# EAGLE design 2x_Rollo_APP_TS_v0.1 (EAGLE 6.4)
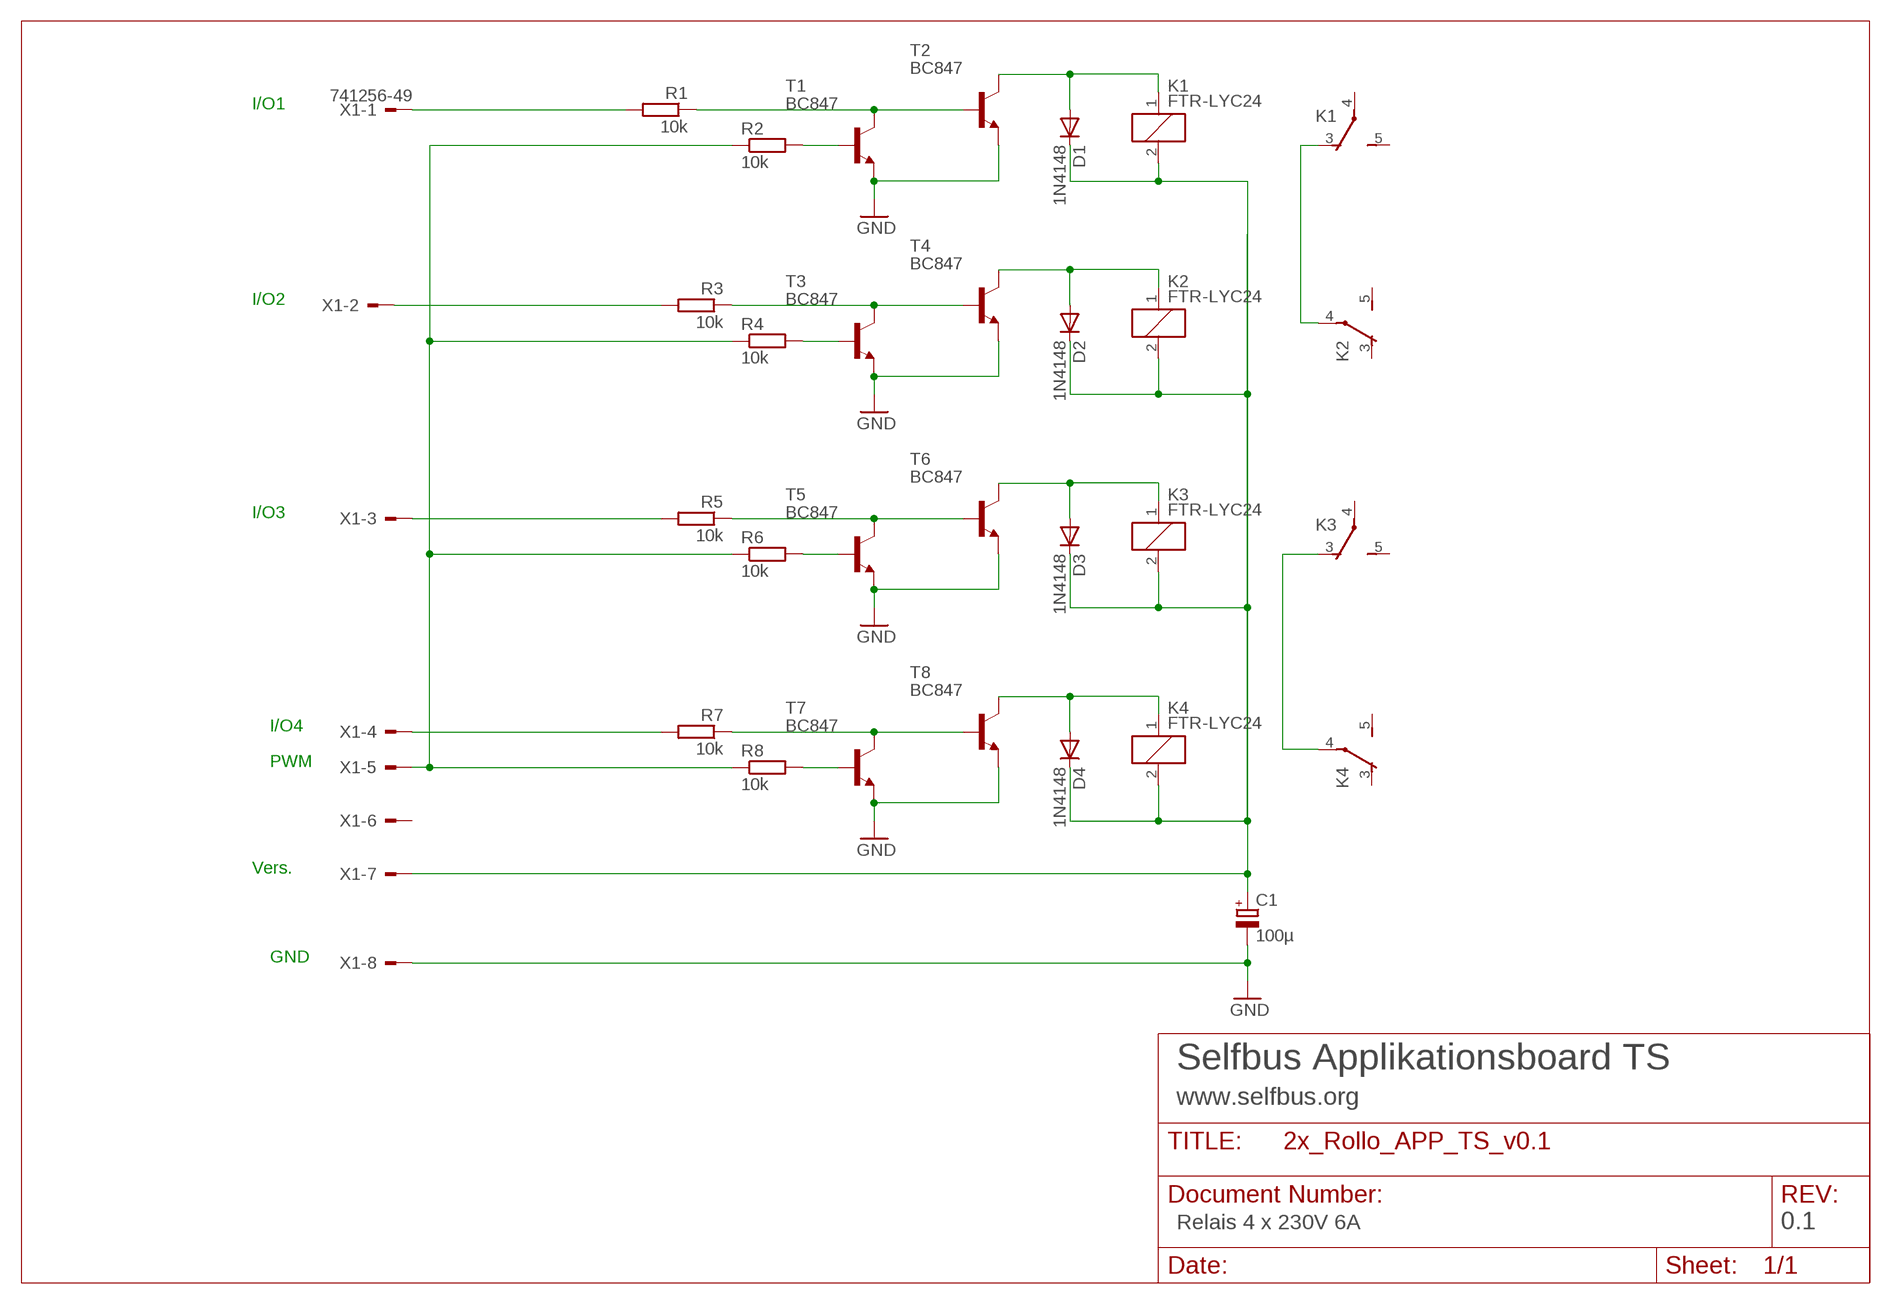
[diagram p0: schematic, sheet 1]

## Parts
C1  100µ  CPOL-EUE2.5-6  [E2,5-6]
D1  1N4148  DIODE-MINIMELF  [MINIMELF]
D2  1N4148  DIODE-MINIMELF  [MINIMELF]
D3  1N4148  DIODE-MINIMELF  [MINIMELF]
D4  1N4148  DIODE-MINIMELF  [MINIMELF]
K1  FTR-LYC24  [FTR-LYC]
K2  FTR-LYC24  [FTR-LYC]
K3  FTR-LYC24  [FTR-LYC]
K4  FTR-LYC24  [FTR-LYC]
R1  10k  R-EU_M1206  [M1206]
R2  10k  R-EU_M1206  [M1206]
R3  10k  R-EU_M1206  [M1206]
R4  10k  R-EU_M1206  [M1206]
R5  10k  R-EU_M1206  [M1206]
R6  10k  R-EU_M1206  [M1206]
R7  10k  R-EU_M1206  [M1206]
R8  10k  R-EU_M1206  [M1206]
T1  BC847  [SOT23]
T2  BC847  [SOT23]
T3  BC847  [SOT23]
T4  BC847  [SOT23]
T5  BC847  [SOT23]
T6  BC847  [SOT23]
T7  BC847  [SOT23]
T8  BC847  [SOT23]
X1  741256-49  [741256-49]

## Nets
GND: C1.- T1.2(E) T2.2(E) T3.2(E) T4.2(E) T5.2(E) T6.2(E) T7.2(E) T8.2(E) X1.8
N$2: R1.2 X1.1
N$4: R3.2 X1.2
N$7: R2.1 R4.1 R6.1 R8.1 X1.5
N$8: R3.1 T3.3(C) T4.1(B)
N$9: R4.2 T3.1(B)
N$10: R5.2 X1.3
N$11: R5.1 T5.3(C) T6.1(B)
N$12: R6.2 T5.1(B)
N$13: R7.2 X1.4
N$14: R1.1 T1.3(C) T2.1(B)
N$15: R7.1 T7.3(C) T8.1(B)
N$18: R8.2 T7.1(B)
N$21: R2.2 T1.1(B)
N$29: K3.3(-1:O) K4.4(-1:P)
N$31: K1.3(-1:O) K2.4(-1:P)
R1: D2.A K2.1 T4.3(C)
R2: D3.A K3.1 T6.3(C)
R3: D1.A K1.1 T2.3(C)
R4: D4.A K4.1 T8.3(C)
VDD_IN1: C1.+ D1.C D2.C D3.C D4.C K1.2 K2.2 K3.2 K4.2 X1.7
Unconnected: K1.4(-1:P) K1.5(-1:S) K2.3(-1:O) K2.5(-1:S) K3.4(-1:P) K3.5(-1:S) K4.3(-1:O) K4.5(-1:S) X1.6

## Notes on the sheet
- I/O1
- I/O2
- I/O3
- I/O4
- PWM
- Vers.
- GND
- Selfbus Applikationsboard TS
- www.selfbus.org
- Relais 4 x 230V 6A | 0.1

## Library data of the parts
C1 = rcl:CPOL-EU: POLARIZED CAPACITOR, European symbol
D1-D4 = diode:DIODE-: DIODE
K1-K4 = relay:FTR-LYC: Schmales Netzrelais NETZRELAIS FTR-LYCA024V 1XUM 6A/250VAC Distributor: Conrad electronic Bestell Nr.: 504382 - 62 Source: http://www2.produktinfo.conrad.com/datenblaetter/500000-524999/504382-da-01-de-NETZRELAIS_FTR-LYCA024V_1XUM_6A_250VAC.pdf; OC_FARNELL: unknown; OC_NEWARK: unknown
R1-R8 = rcl:R-EU_: RESISTOR, European symbol
T1-T8 = transistor:BC847: NPN TRANSISTOR
X1 = con-conrad:741256-49: Connector with Kabel

## Board
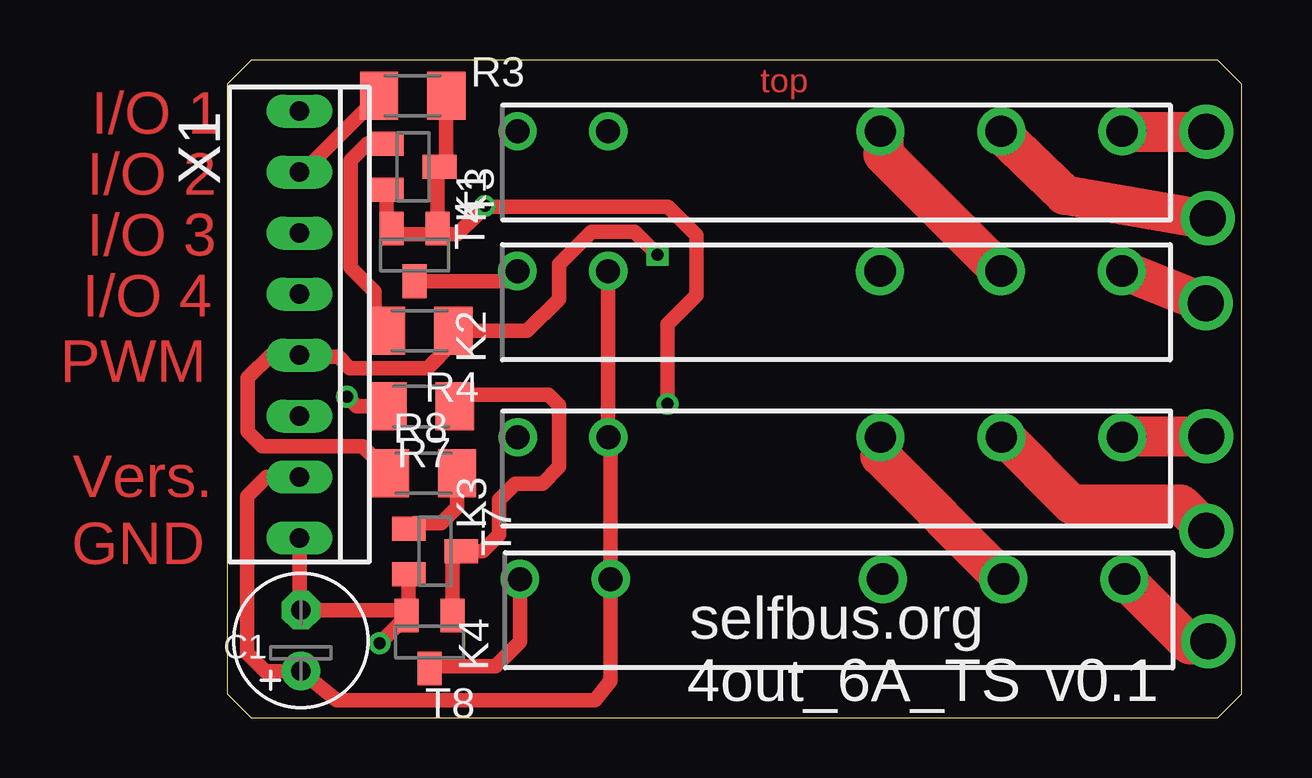
[diagram p1: board, top side]
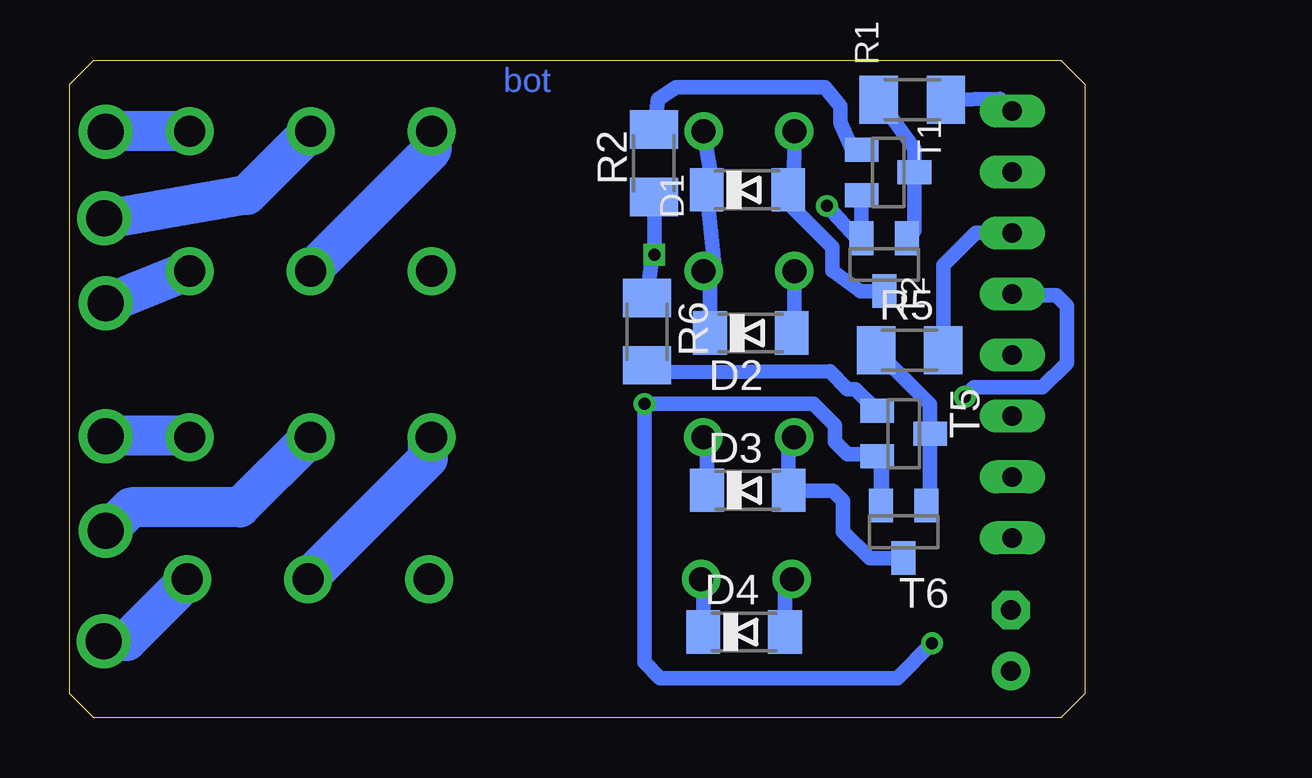
[diagram p2: board, bottom side, seen from below]

Size 42.3 x 27.4 mm. Coordinates in mm from the lower left corner, seen from the top.
Outline: 1,0 41.3,0 42.3,1 42.3,26.4 41.3,27.4 1,27.4 0,26.4 0,1 1,0
Copper layers (1*16): Top 0.035mm / dielectric 1.5mm / Bottom 0.035mm
Design rules "default_freebus": minimum track width 10mil, minimum drill 24mil, track to track 8mil, track to pad 8mil, pad to pad 8mil, via to via 8mil, smd to smd 8mil, copper to edge 12mil, drill to drill 8mil, minimum pad ring 11mil, minimum via ring 8mil, stop-mask expansion 4mil, vias tented up to drill 0mil, thermal gap 10mil

### Footprints (pad centres in the part's own frame; a part is rotated, then mirrored left to right if it is on the bottom)
E2,5-6 = drill 0.813 pad 1.6: + -1.27,0 | drill 0.813 pad 1.6 octagon: - 1.27,0
MINIMELF = smd 1.4 x 1.8: A 1.7,0; C -1.7,0
FTR-LYC = drill 1 pad 1.6: 1 -3.78,0; 2 0,0 | drill 1.3 pad 2: 3 11.34,0; 4 16.38,0; 5 21.42,0
M1206 = smd 1.6 x 2: 1 -1.4,0; 2 1.4,0
SOT23 = smd 1 x 1.4: 1 -0.95,-1.1; 2 0.95,-1.1; 3 0,1.1
741256-49 = drill 0.813 pad 1.27 long: 1 -8.89,0; 2 -6.35,0; 3 -3.81,0; 4 -1.27,0; 5 1.27,0; 6 3.81,0; 7 6.35,0; 8 8.89,0

### Placement (x,y rotation side)
C1  3.08,3.21 90 top
D1  14.06,21.99 0 bottom
D2  13.92,16.02 0 bottom
D3  14.04,9.47 0 bottom
D4  14.19,3.57 0 bottom
K1  15.89,24.43 0 top
K2  15.88,18.6 0 top
K3  15.89,11.68 0 top
K4  15.99,5.77 0 top
R1  7.19,25.74 0 bottom
R2  17.96,23.1 90 bottom
R3  7.74,25.91 180 top
R4  8.03,16.11 180 top
R5  7.29,15.31 0 bottom
R6  18.24,16.08 270 bottom
R7  8.09,12.96 180 top
R8  8.18,10.18 0 top
T1  8.2,22.72 270 bottom
T2  8.36,18.87 180 bottom
T3  7.75,22.95 270 top
T4  7.82,19.28 180 top
T5  7.55,11.83 270 bottom
T6  7.55,7.74 180 bottom
T7  8.67,6.93 270 top
T8  8.44,3.15 180 top
X1  3.01,16.38 270 top

### Tracks (layer width: path | path; a pad name or v marks a point on that pad's centre or on a via)
GND  (via drill 0.5)
  Top 0.61: X1.8 3.01,4.54 C1.- 7.26,4.48 T8.2 7.57,4.33 T7.2 7.57,4.69 7.36,4.47 7.36,4.09 v6.36,3.09 | T3.2 6.65,20.59 T4.2 7.11,20.14 9.6,20.14 10.39,20.94 v10.75,21.32 10.78,21.28 18.38,21.28 19.57,20.1 19.57,17.59 18.35,16.38 v18.35,13.07
  Bottom 0.61: T1.2 9.3,19.98 | 9.3,19.98 T2.2 | T5.2 8.5,10.73 T6.2 8.45,8.9 8.45,10.93 8.49,10.97 9.88,10.97 10.41,11.5 10.41,12.18 11.3,13.07 v18.35,13.07 18.35,2.31 17.69,1.65 7.8,1.65 v6.36,3.09 | 9.3,19.98 9.47,19.96 v10.75,21.32
N$1  (via drill 1.5 pad 2.18)
  Top 1.676: 37.31,24.39 37.31,24.42 v40.81,24.42
N$2
  Bottom 0.61: X1.1 3.52,25.78 R1.2
N$3  (via drill 1.5 pad 2.18)
  other vias: 40.88,20.8
N$4
  Top 0.61: X1.2 3.15,22.73 R3.2
N$5  (via drill 1.5 pad 2.18)
  Top 1.676: 37.29,18.66 v40.8,17.26
N$6
  Top 1.676: 27.35,24.47 27.35,23.47 32.2,18.63
N$7  (via drill 0.5)
  Top 0.61: v17.94,19.29 16.97,20.25 15.2,20.25 13.83,18.88 13.83,17.43 12.51,16.12 R4.1 9.43,15.64 8.36,14.56 5.11,14.56 4.64,15.03 3.09,15.03 X1.5 1.81,15.11 0.85,14.15 0.85,11.91 1.45,11.3 5.66,11.3 R8.1
  Bottom 0.61: v17.94,19.29 17.94,21.68 R2.1 | 17.96,19.26 v17.94,19.29 | R6.1 18.03,19.19 v17.94,19.29
N$8
  Top 0.61: R3.1 9.14,23.23 T3.3 8.77,22.86 T4.1
N$9
  Top 0.61: T3.1 5.84,23.9 5.15,23.22 5.15,18.74 6.16,17.74 6.16,16.59 R4.2
N$10
  Bottom 0.61: R5.2 5.89,18.85 4.53,20.21 3.04,20.21 X1.3
N$11
  Bottom 0.61: R5.1 6.45,13.06 T5.3 6.45,9 T6.1
N$12
  Bottom 0.61: T5.1 9.56,13.69 9.88,13.69 10.63,14.44 10.62,14.42 17.47,14.38 17.77,14.68 R6.2
N$13  (via drill 0.5)
  Top 0.61: R7.2 5.41,12.96 v5,13.37
  Bottom 0.61: v5,13.37 4.61,13.76 1.75,13.76 0.75,14.77 0.75,17.16 1.19,17.6 2.97,17.6 X1.4
N$14
  Bottom 0.61: R1.1 7.1,23.69 T1.3 7.1,20.28 T2.1
N$15
  Top 0.61: T8.1 9.39,6.55 T7.3 10.64,6.93 11.34,7.63 11.34,9.08 12.01,9.75 13.15,9.75 13.84,10.44 13.84,13.01 13.4,13.46 9.99,13.46 R7.1
N$16  (via drill 1.5 pad 2.18)
  Top 1.676: 37.37,11.72 v40.81,11.72
N$17  (via drill 1.5 pad 2.18)
  other vias: 40.81,7.79
N$18
  Top 0.61: R8.2 9.58,8.76 8.93,8.1 7.8,8.1 T7.1
N$19  (via drill 1.5 pad 2.18)
  other vias: 40.9,3.17
N$20
  Bottom 1.676: 40.84,3.19 39.93,3.19 37.36,5.76
N$21
  Bottom 0.61: T1.1 9.67,23.67 10.18,24.79 10.18,25.48 10.83,26.27 17.04,26.27 17.79,25.77 17.88,24.87 R2.2
N$22
  Top 1.676: 32.23,24.36 34.91,21.78 41.04,20.73
N$23
  Bottom 1.676: 37.3,24.43 40.92,24.43 40.87,24.67
N$24
  Bottom 1.676: 32.21,24.49 34.91,21.78 40.85,20.74
N$25
  Bottom 1.676: 40.84,17.22 37.39,18.61
N$26
  Top 1.676: 41.02,3.04 40.14,3.04 37.39,5.79
N$27
  Bottom 1.676: 37.29,11.71 37.32,11.75 40.83,11.75
N$28
  Bottom 1.676: 32.31,11.67 35.22,8.76 39.75,8.76 40.68,7.83
N$29
  Top 1.676: K3.3 27.23,10.91 K4.4
N$30
  Bottom 1.676: 27.38,11.7 27.38,10.79 32.34,5.83
N$31
  Bottom 1.676: K1.3 27.23,23.64 K2.4
N$32
  Top 1.676: 32.37,11.74 35.22,8.89 39.75,8.89 40.87,7.76
R1
  Top 0.61: T4.3 11.68,18.18 K2.1
  Bottom 0.61: K2.1 12.1,16.14 D2.A
R2
  Bottom 0.61: K3.1 12.34,11.45 D3.A 12.32,9.45 10.48,9.45 10.07,9.04 10.07,7.75 8.96,6.64 T6.3
R3
  Bottom 0.61: K1.1 12.13,22.05 D1.A 12.31,21.4 10.79,19.87 10.52,19.6 10.52,19.49 10.52,18.61 9.35,17.77 T2.3
R4
  Top 0.61: K4.1 12.21,3.16 11.19,2.14 8.53,2.14 T8.3
  Bottom 0.61: D4.A 12.49,5.49 K4.1
VDD_IN1
  Top 0.61: X1.7 1.64,10.03 0.84,9.22 0.84,2.69 1.59,1.93 3.07,1.93 C1.+ 4.57,0.72 15.34,0.72 15.99,1.54 K4.2 15.99,11.59 K3.2 K2.2
  Bottom 0.61: K1.2 15.48,22.01 D1.C 15.45,19.04 K2.2 15.62,18.34 D2.C | K3.2 15.74,11.53 D3.C | D4.C 15.89,5.68 K4.2

### Text on the board
Top: top | I/O 1 | I/O 2 | I/O 3 | I/O 4 | PWM | Vers. | GND
Bottom: bot
tNames: selfbus.org | 4out_6A_TS | v0.1